# EasyEDA schematic SCH_2.4G无线通信模块-SI24R1_2024-07-24.json
TITLE: 2.4G无线通信_SI24R1 V1.0; REV: 1.0; Date: 2017-11-10; Sheet: 1/1; Drawn By: jixin-team
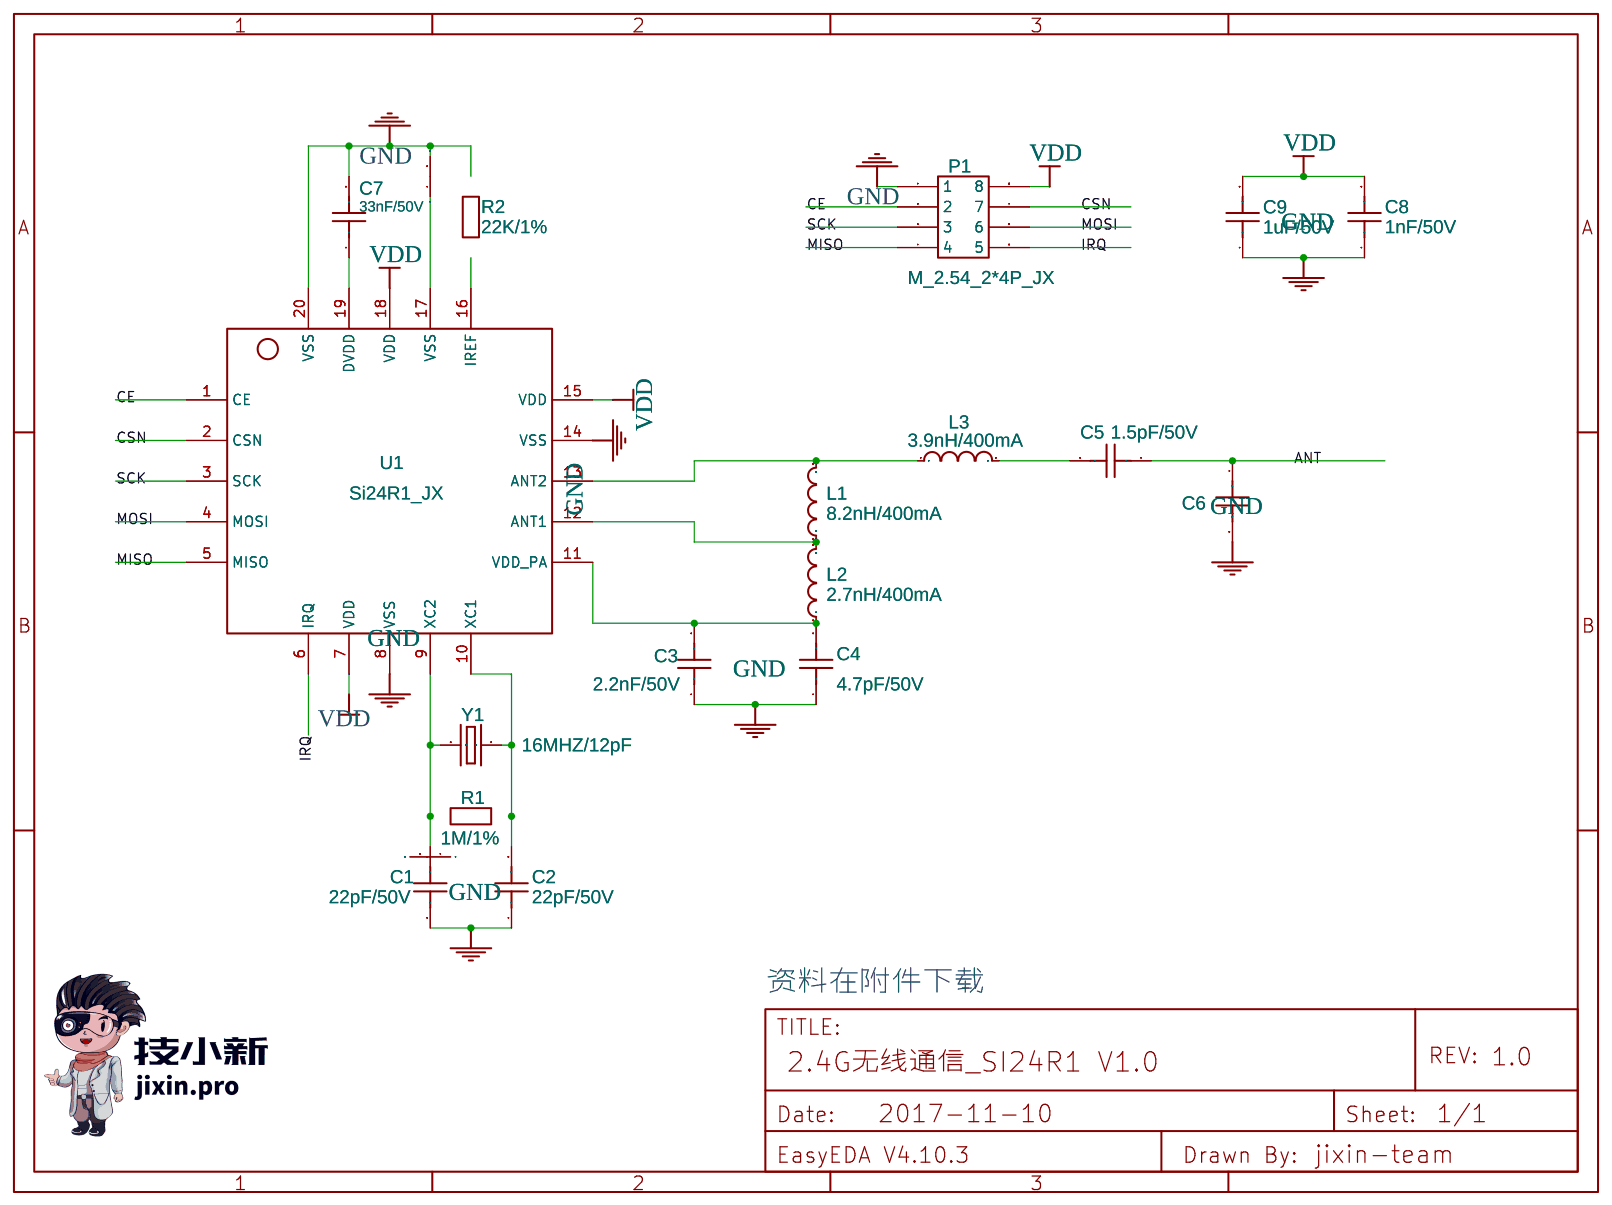
[diagram p0: schematic sheet]

## Parts
C1  22pF/50V  [0603_C_JX]
C2  22pF/50V  [0603_C_JX]
C3  2.2nF/50V  [0603_C_JX]
C4  4.7pF/50V  [0603_C_JX]
C5  1.5pF/50V  [0603_C_JX]
C6  (1pF)  [0603_C_JX]
C7  33nF/50V  [0603_C_JX]
C8  1nF/50V  [0603_C_JX]
C9  1uF/50V  [0603_C_JX]
L1  8.2nH/400mA  [0603_L_JX]
L2  2.7nH/400mA  [0603_L_JX]
L3  3.9nH/400mA  [0603_L_JX]
P1  M_2.54_2*4P_JX  [M_2.54_2*4P_JX]
R1  1M/1%  [0603_R_JX]
R2  22K/1%  [0603_R_JX]
U1  Si24R1_JX  [QFN20_4X4X05P_JX]
Y1  16MHZ/12pF  [SMD-3225_4P_JX]

## Library data of the parts
C1-C5 C7-C9 = Capacitor: Supplier: LCSC
C6 = Capacitor: Supplier: LCSC; Mounted: No
L1-L3 = Inductor: Supplier: LCSC
P1 = -: Supplier: LCSC
R1 R2 = Resistor: Supplier: LCSC
U1 = -: Supplier: LCSC; Manufacturer Part: ?
Y1 = -: catid: 20; Supplier: LCSC

## Nets
GND: C1.1 C2.1 C3.1 C4.1 C6.2 C7.2 C8.1 C9.1 P1.1 R2.1 U1.8(VSS) U1.14(VSS) U1.17(VSS) U1.20(VSS)
VDD: C8.2 C9.2 P1.8 U1.7(VDD) U1.15(VDD) U1.18(VDD)
ANT: C5.1 C6.1
CE: P1.2 U1.1(CE)
CSN: P1.7 U1.2(CSN)
IRQ: P1.5 U1.6(IRQ)
MISO: P1.4 U1.5(MISO)
MOSI: P1.6 U1.4(MOSI)
SCK: P1.3 U1.3(SCK)
L3_2: C5.2 L3.2
U1_9: C1.2 R1.1 U1.9(XC2) Y1.3
U1_10: C2.2 R1.2 U1.10(XC1) Y1.1
U1_11: C3.2 C4.2 L2.1 U1.11(VDD_PA)
U1_12: L1.1 L2.2 U1.12(ANT1)
U1_13: L1.2 L3.1 U1.13(ANT2)
U1_16: R2.2 U1.16(IREF)
U1_19: C7.1 U1.19(DVDD)

## Notes on the sheet
- 资料在附件下载
